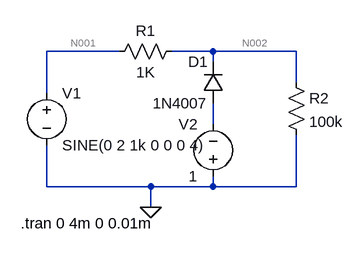
[diagram p0: schematic NEGATIVE_CLIPPER.asc]
NEGATIVE_CLIPPER.asc, the LTspice schematic file:
Version 4.1
SHEET 1 880 680
WIRE 160 96 48 96
WIRE 304 96 240 96
WIRE 432 96 304 96
WIRE 304 112 304 96
WIRE 432 144 432 96
WIRE 48 160 48 96
WIRE 304 208 304 176
WIRE 48 304 48 240
WIRE 208 304 48 304
WIRE 304 304 304 288
WIRE 304 304 208 304
WIRE 432 304 432 224
WIRE 432 304 304 304
WIRE 208 336 208 304
FLAG 208 336 0
SYMBOL voltage 48 144 R0
WINDOW 123 0 0 Left 0
WINDOW 39 0 0 Left 0
SYMATTR InstName V1
SYMATTR Value SINE(0 2 1k 0 0 0 4)
SYMBOL res 256 80 R90
WINDOW 0 0 56 VBottom 2
WINDOW 3 32 56 VTop 2
SYMATTR InstName R1
SYMATTR Value 1K
SYMBOL diode 320 176 R180
WINDOW 0 24 64 Left 2
WINDOW 3 24 0 Left 2
SYMATTR InstName D1
SYMATTR Value 1N4007
SYMBOL voltage 304 304 R180
WINDOW 0 24 96 Left 2
WINDOW 3 24 16 Left 2
SYMATTR InstName V2
SYMATTR Value 1
SYMBOL res 416 128 R0
SYMATTR InstName R2
SYMATTR Value 100k
TEXT 8 360 Left 2 !.tran 0 4m 0 0.01m

The netlist it stands for:
* NEGATIVE_CLIPPER.asc
V1 N001 0 SINE(0 2 1k 0 0 0 4)
R1 N002 N001 1K
D1 N003 N002 1N4007
V2 0 N003 1
R2 N002 0 100k
.model D D
.lib standard.dio
.tran 0 4m 0 0.01m
.backanno
.end

* Results of the author's LTspice run, read from the files saved beside the schematic
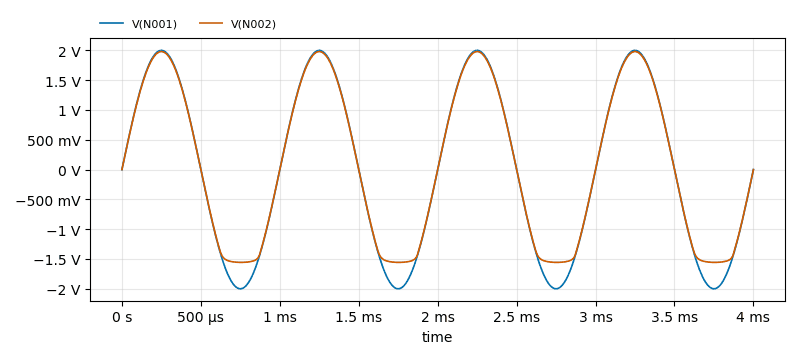
[diagram p1: Transient Analysis of NEGATIVE_CLIPPER.asc, plotted from the saved traces]
* Transient Analysis, 1 run:
*   V(N001): min -2 V, max 2 V, average -22.26 µV, rms 1.414 V, last 0 V
*   V(N002): min -1.557 V, max 1.98 V, average 63.92 mV, rms 1.32 V, last -139.1 µV